# EAGLE design BBB_Breakout_Cape.0 (EAGLE 6.5.0)
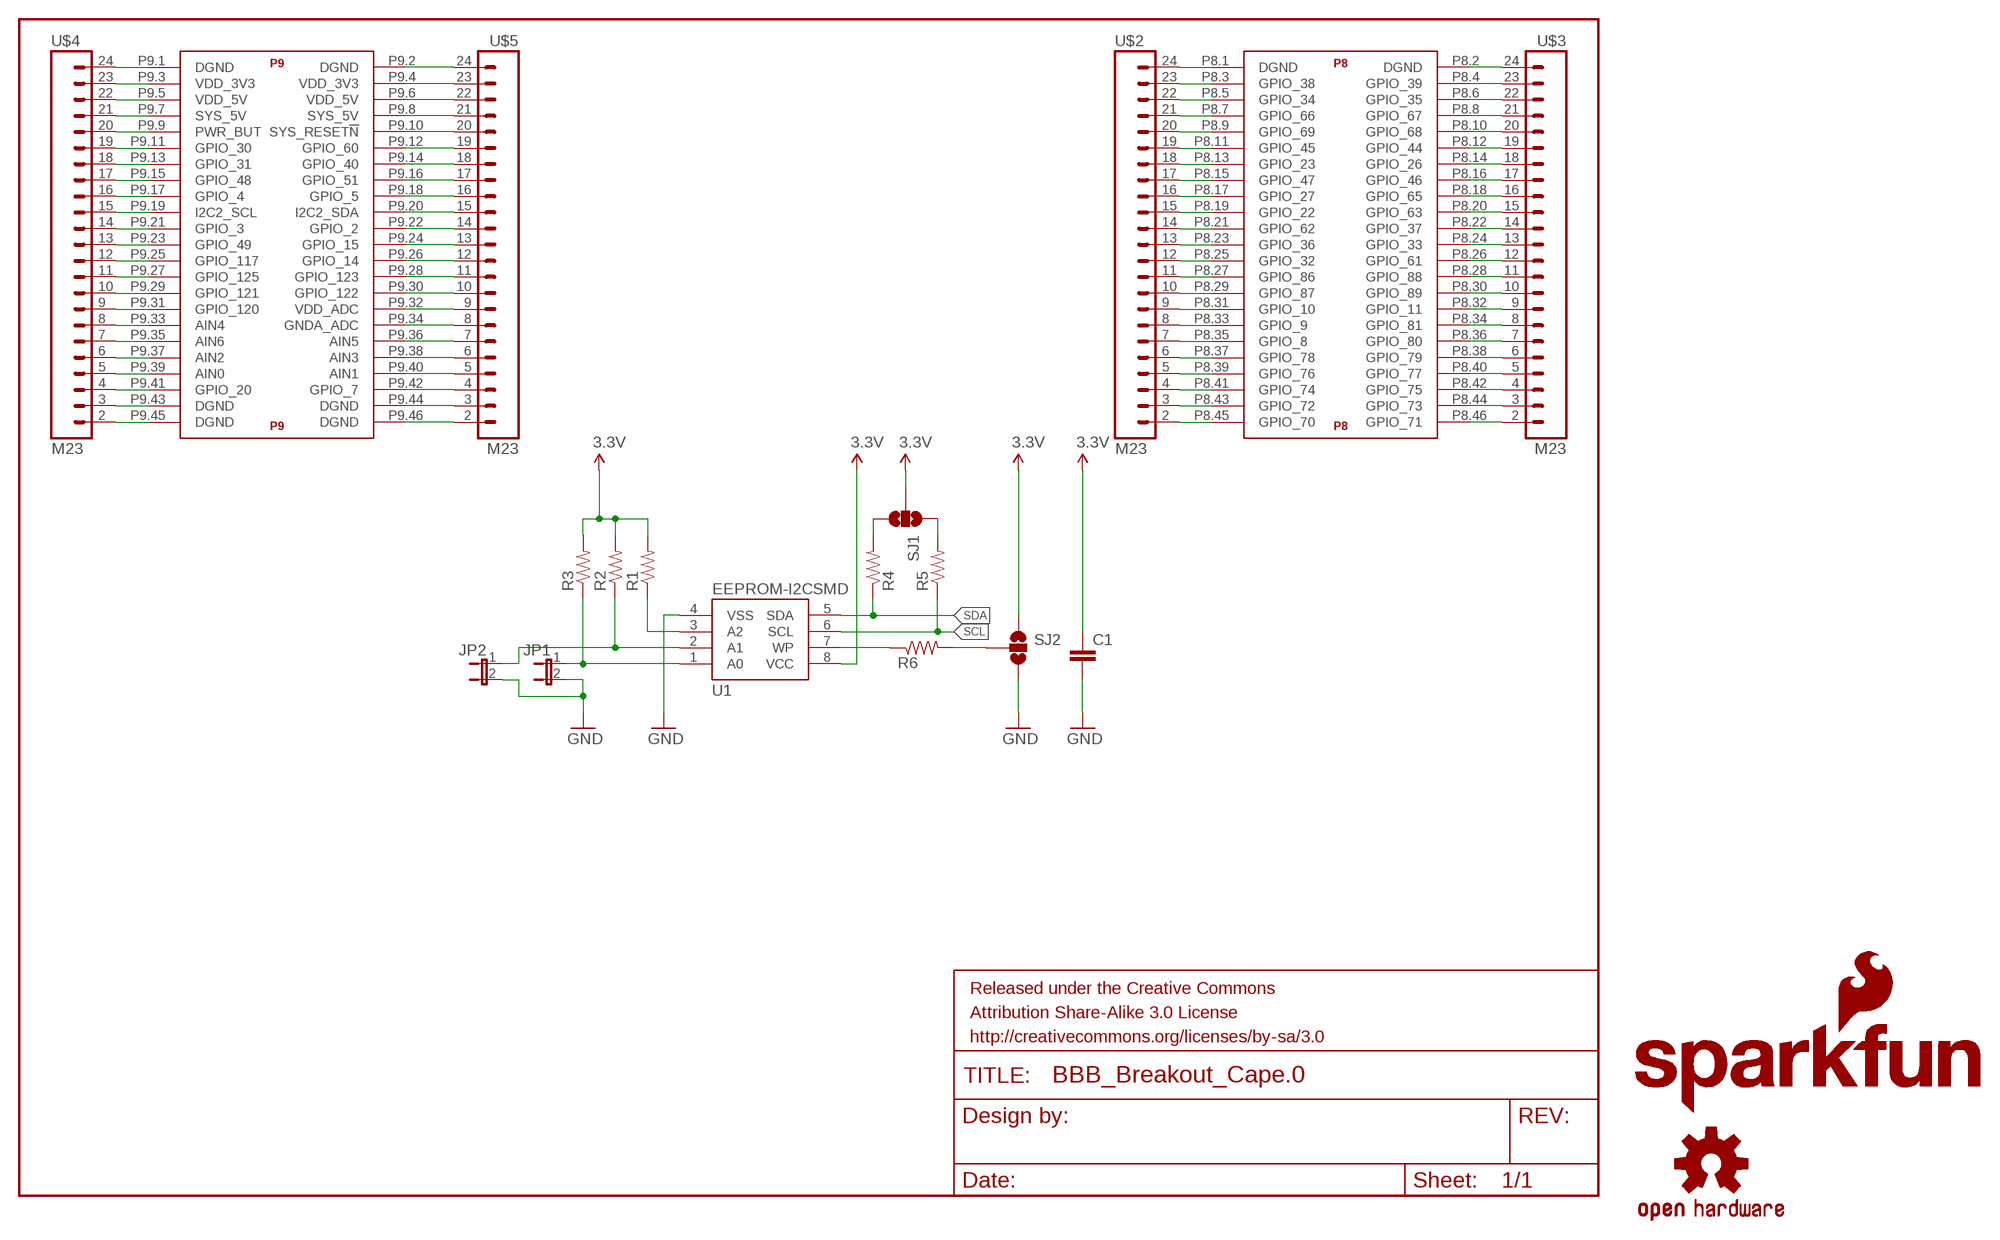
[diagram p0: schematic, sheet 1]

## Parts
C1  0.1UF-25V(+80/-20%)(0603)  [0603-CAP]
FRAME1  FRAME-LETTER  [CREATIVE_COMMONS]
JP1  JUMPER-2SMD-NO  [SJ_2S-NO]
JP2  JUMPER-2SMD-NO  [SJ_2S-NO]
LOGO2  OSHW-LOGOS  [OSHW-LOGO-S]
LOGO3  SFE_LOGO_NAME_FLAME.1_INCH  [SFE_LOGO_NAME_FLAME_.1]
R1  4.7KOHM1/10W1%(0603)  [0603]
R2  4.7KOHM1/10W1%(0603)  [0603]
R3  4.7KOHM1/10W1%(0603)  [0603]
R4  4.7KOHM1/10W1%(0603)  [0603]
R5  4.7KOHM1/10W1%(0603)  [0603]
R6  10KOHM1/10W1%(0603)0603  [0603-RES]
SJ1  SOLDERJUMPER_2WAYPASTE1&2&3  [SJ_3_PASTE1&2&3]
SJ2  SOLDERJUMPER_2WAYPASTE2&3  [SJ_3_PASTE2&3]
U1  EEPROM-I2CSMD  [SO08]
U$1  BEAGLE_BONE_BLACK_CAPE  [BEAGLE_BONE_BLACK_CAPE]
U$2  M23  [1X23]
U$3  M23  [1X23]
U$4  M23  [1X23]
U$5  M23  [1X23]

## Nets
3.3V: C1.1 R1.2 R2.2 R3.2 SJ1.2 SJ2.1 U1.8(VCC)
GND: C1.2 JP1.2 JP2.2 SJ2.3 U1.4(VSS)
N$1: R6.1 U1.7(WP)
N$2: U$1.P8.45(P8:GPIO_70) U$2.2
N$3: R6.2 SJ2.2
N$4: U$1.P8.43(P8:GPIO_72) U$2.3
N$5: U$1.P8.41(P8:GPIO_74) U$2.4
N$6: R1.1 U1.3(A2)
N$7: JP2.1 R2.1 U1.2(A1)
N$8: JP1.1 R3.1 U1.1(A0)
N$9: U$1.P8.39(P8:GPIO_76) U$2.5
N$10: R4.2 SJ1.3
N$11: R5.2 SJ1.1
N$12: U$1.P8.37(P8:GPIO_78) U$2.6
N$13: U$1.P8.35(P8:GPIO_8) U$2.7
N$14: U$1.P8.33(P8:GPIO_9) U$2.8
N$15: U$1.P8.31(P8:GPIO_10) U$2.9
N$16: U$1.P8.29(P8:GPIO_87) U$2.10
N$17: U$1.P8.27(P8:GPIO_86) U$2.11
N$18: U$1.P8.25(P8:GPIO_32) U$2.12
N$19: U$1.P8.23(P8:GPIO_36) U$2.13
N$20: U$1.P8.21(P8:GPIO_62) U$2.14
N$21: U$1.P8.19(P8:GPIO_22) U$2.15
N$22: U$1.P8.17(P8:GPIO_27) U$2.16
N$23: U$1.P8.15(P8:GPIO_47) U$2.17
N$24: U$1.P8.13(P8:GPIO_23) U$2.18
N$25: U$1.P8.11(P8:GPIO_45) U$2.19
N$26: U$1.P8.9(P8:GPIO_69) U$2.20
N$27: U$1.P8.7(P8:GPIO_66) U$2.21
N$28: U$1.P8.5(P8:GPIO_34) U$2.22
N$29: U$1.P8.3(P8:GPIO_38) U$2.23
N$30: U$1.P8.1(P8:DGND) U$2.24
N$31: U$1.P8.46(P8:GPIO_71) U$3.2
N$32: U$1.P8.44(P8:GPIO_73) U$3.3
N$33: U$1.P8.42(P8:GPIO_75) U$3.4
N$34: U$1.P8.40(P8:GPIO_77) U$3.5
N$35: U$1.P8.38(P8:GPIO_79) U$3.6
N$36: U$1.P8.36(P8:GPIO_80) U$3.7
N$37: U$1.P8.34(P8:GPIO_81) U$3.8
N$38: U$1.P8.32(P8:GPIO_11) U$3.9
N$39: U$1.P8.30(P8:GPIO_89) U$3.10
N$40: U$1.P8.28(P8:GPIO_88) U$3.11
N$41: U$1.P8.26(P8:GPIO_61) U$3.12
N$42: U$1.P8.24(P8:GPIO_33) U$3.13
N$43: U$1.P8.22(P8:GPIO_37) U$3.14
N$44: U$1.P8.20(P8:GPIO_63) U$3.15
N$45: U$1.P8.18(P8:GPIO_65) U$3.16
N$46: U$1.P8.16(P8:GPIO_46) U$3.17
N$47: U$1.P8.14(P8:GPIO_26) U$3.18
N$48: U$1.P8.12(P8:GPIO_44) U$3.19
N$49: U$1.P8.10(P8:GPIO_68) U$3.20
N$50: U$1.P8.8(P8:GPIO_67) U$3.21
N$51: U$1.P8.6(P8:GPIO_35) U$3.22
N$52: U$1.P8.4(P8:GPIO_39) U$3.23
N$53: U$1.P8.2(P8:DGND) U$3.24
N$54: U$1.P9.46(P9:DGND) U$5.2
N$55: U$1.P9.44(P9:DGND) U$5.3
N$56: U$1.P9.42(P9:GPIO_7) U$5.4
N$57: U$1.P9.40(P9:AIN1) U$5.5
N$58: U$1.P9.38(P9:AIN3) U$5.6
N$59: U$1.P9.36(P9:AIN5) U$5.7
N$60: U$1.P9.34(P9:GNDA_ADC) U$5.8
N$61: U$1.P9.32(P9:VDD_ADC) U$5.9
N$62: U$1.P9.30(P9:GPIO_122) U$5.10
N$63: U$1.P9.28(P9:GPIO_123) U$5.11
N$64: U$1.P9.26(P9:GPIO_14) U$5.12
N$65: U$1.P9.24(P9:GPIO_15) U$5.13
N$66: U$1.P9.22(P9:GPIO_2) U$5.14
N$67: U$1.P9.20(P9:I2C2_SDA) U$5.15
N$68: U$1.P9.18(P9:GPIO_5) U$5.16
N$69: U$1.P9.16(P9:GPIO_51) U$5.17
N$70: U$1.P9.14(P9:GPIO_40) U$5.18
N$71: U$1.P9.12(P9:GPIO_60) U$5.19
N$72: U$1.P9.10(P9:SYS_RESET!N) U$5.20
N$73: U$1.P9.8(P9:SYS_5V) U$5.21
N$74: U$1.P9.6(P9:VDD_5V) U$5.22
N$75: U$1.P9.4(P9:VDD_3V3) U$5.23
N$76: U$1.P9.2(P9:DGND) U$5.24
N$77: U$1.P9.45(P9:DGND) U$4.2
N$78: U$1.P9.43(P9:DGND) U$4.3
N$79: U$1.P9.41(P9:GPIO_20) U$4.4
N$80: U$1.P9.39(P9:AIN0) U$4.5
N$81: U$1.P9.37(P9:AIN2) U$4.6
N$82: U$1.P9.35(P9:AIN6) U$4.7
N$83: U$1.P9.33(P9:AIN4) U$4.8
N$84: U$1.P9.31(P9:GPIO_120) U$4.9
N$85: U$1.P9.29(P9:GPIO_121) U$4.10
N$86: U$1.P9.27(P9:GPIO_125) U$4.11
N$87: U$1.P9.25(P9:GPIO_117) U$4.12
N$88: U$1.P9.23(P9:GPIO_49) U$4.13
N$89: U$1.P9.21(P9:GPIO_3) U$4.14
N$90: U$1.P9.19(P9:I2C2_SCL) U$4.15
N$91: U$1.P9.17(P9:GPIO_4) U$4.16
N$92: U$1.P9.15(P9:GPIO_48) U$4.17
N$93: U$1.P9.13(P9:GPIO_31) U$4.18
N$94: U$1.P9.11(P9:GPIO_30) U$4.19
N$95: U$1.P9.9(P9:PWR_BUT) U$4.20
N$96: U$1.P9.7(P9:SYS_5V) U$4.21
N$97: U$1.P9.5(P9:VDD_5V) U$4.22
N$98: U$1.P9.3(P9:VDD_3V3) U$4.23
N$99: U$1.P9.1(P9:DGND) U$4.24
SCL: R5.1 U1.6(SCL)
SDA: R4.1 U1.5(SDA)

## Library data of the parts
C1 = SparkFun-Capacitors:0.1UF-25V(+80/-20%)(0603): CAP-00810 Ceramic Standard decoupling cap; PROD_ID: CAP-00810; VALUE: 0.1uF
FRAME1 = SparkFun-Aesthetics:FRAME-LETTER: Schematic Frame Standard 8.5x11 US Letter frame
JP1 JP2 = SparkFun-Passives:JUMPER-2: Jumper Basic 0.1" spaced jumper. Use with breakaway headers.
LOGO2 = SparkFun-Aesthetics:OSHW-LOGO: Open Source Hardware Logo This logo indicates the piece of hardware it is found on incorporates a OSHW license and/or adheres to the definition of open source hardware found here: http://freedomdefined.org/OSHW
LOGO3 = SparkFun-Aesthetics:SFE_LOGO_NAME_FLAME: SFE Logo, name and flame This is the SparkFun full logo. The logo on the schematic will always be the same size; the package variant is the height of the flame part of the logo. Default layer for the logo on the board is tSilk.
R1-R5 = SparkFun-Resistors:4.7KOHM1/10W1%(0603): RES-07857; PROD_ID: RES-07857
R6 = SparkFun-Resistors:10KOHM1/10W1%(0603): RES-00824; PROD_ID: RES-00824; VALUE: 10K
SJ1 SJ2 = SparkFun-Passives:SOLDERJUMPER_2WAY: Solder Jumper 2 way solder jumper
U1 = SparkFun-DigitalIC:EEPROM-I2C: I2C EEPROM chips, 24LC256 (and others)
U$1 = SparkFun-Boards:BEAGLE_BONE_BLACK_CAPE
U$2-U$5 = SparkFun-Connectors:M23

## Board
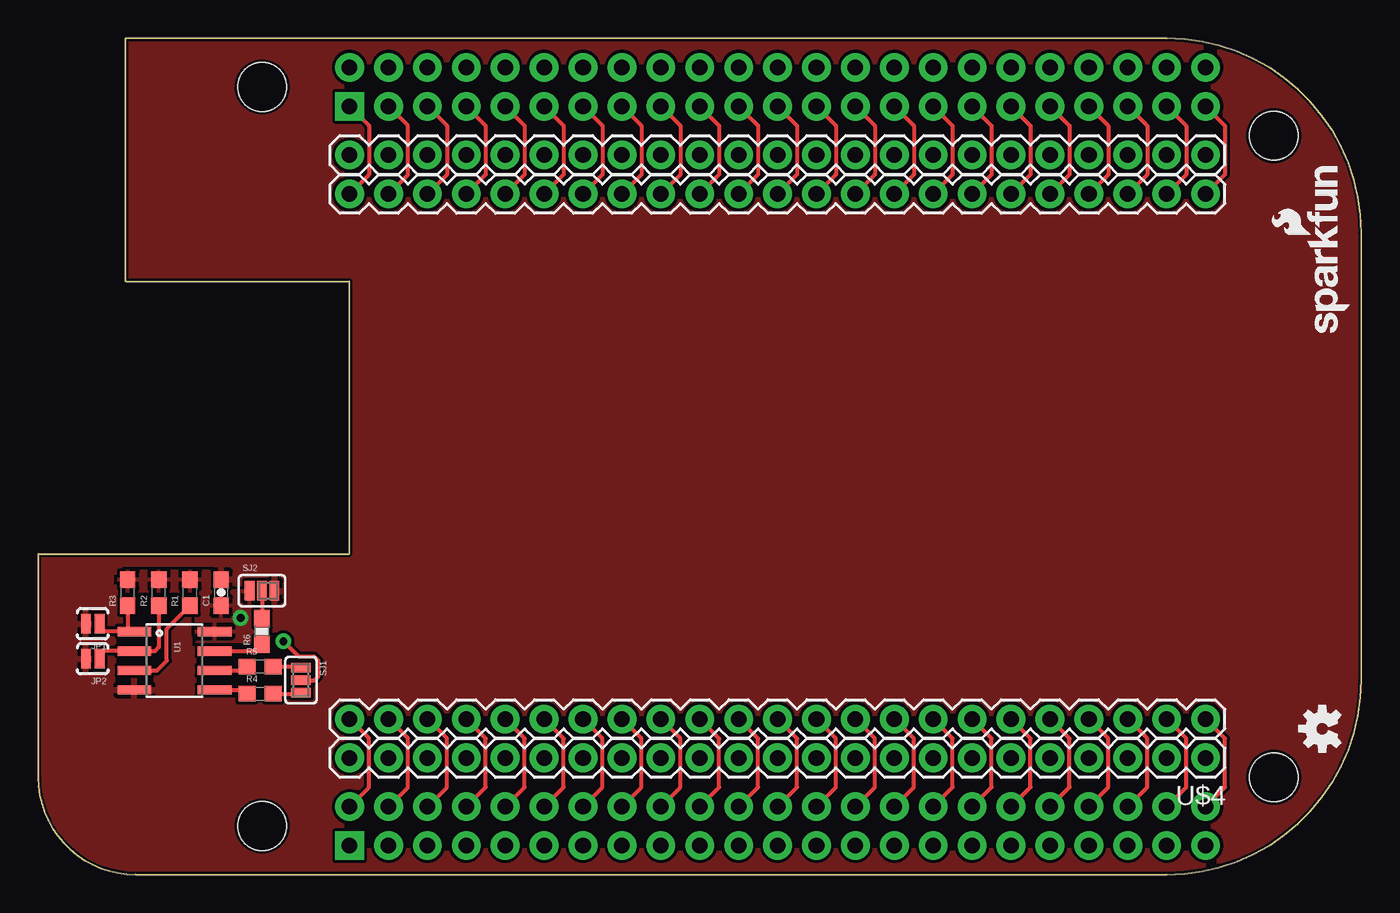
[diagram p1: board, top side]
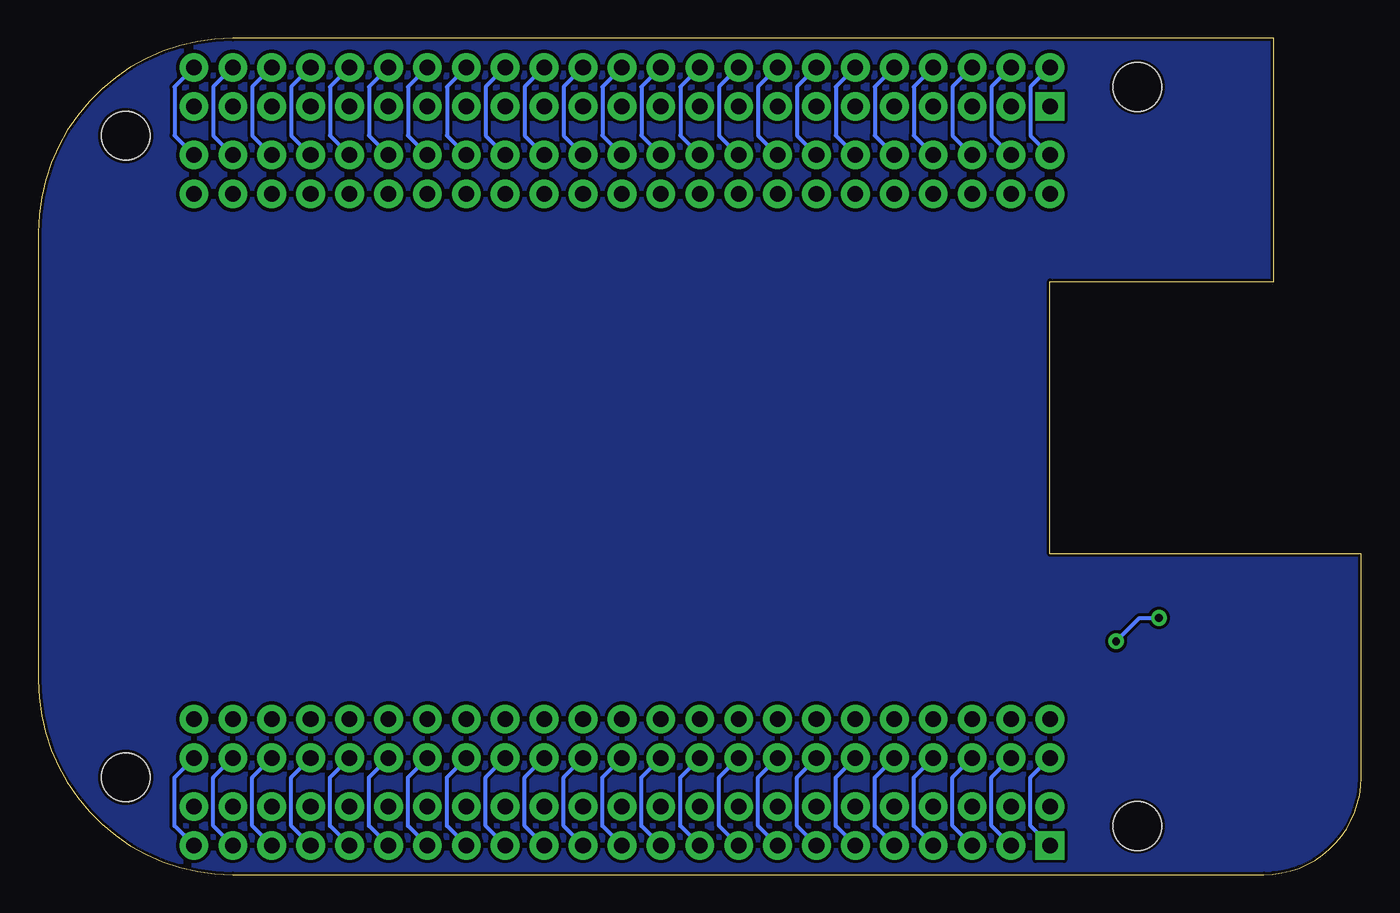
[diagram p2: board, bottom side, seen from below]

Size 86.36 x 54.61 mm. Coordinates in mm from the lower left corner, seen from the top.
Outline: 0,20.95 20.32,20.95 20.32,38.73 5.71,38.73 5.71,54.61 73.66,54.61 arc-90 86.36,41.91 86.36,12.7 arc-90 73.66,0 6.35,0 arc-90 0,6.35 0,20.95
Copper layers (1*16): Top 0.035mm / dielectric 1.5mm / Bottom 0.035mm
Design rules "SparkFun-2-layer": minimum track width 7mil, minimum drill 15mil, track to track 8mil, track to pad 8mil, pad to pad 8mil, via to via 8mil, smd to smd 8mil, copper to edge 8mil, drill to drill 8mil, minimum pad ring 12mil, minimum via ring 10mil, stop-mask expansion 4mil, vias tented up to drill 20mil, thermal gap 10mil

### Footprints (pad centres in the part's own frame; a part is rotated, then mirrored left to right if it is on the bottom)
0603-CAP = smd 1.1 x 1: 1 -0.85,0; 2 0.85,0
SJ_2S-NO = smd 0.635 x 1.27: 1 -0.45,0; 2 0.45,0
0603 = smd 1.1 x 1: 1 -0.85,0; 2 0.85,0
0603-RES = smd 1.1 x 1: 1 -0.85,0; 2 0.85,0
SJ_3_PASTE1&2&3 = smd 0.635 x 1.27: 1 -0.813,0; 2 0,0; 3 0.813,0
SJ_3_PASTE2&3 = smd 0.635 x 1.27: 1 -0.813,0; 2 0,0; 3 0.813,0
SO08 = smd 0.61 x 2.21: 1 -1.905,-2.616; 2 -0.635,-2.616; 3 0.635,-2.616; 4 1.905,-2.616; 5 1.905,2.616; 6 0.635,2.616; 7 -0.635,2.616; 8 -1.905,2.616
BEAGLE_BONE_BLACK_CAPE = drill 1.016 pad 1.88 square: P8.1 20.32,50.165; P9.1 20.32,1.905 | drill 1.016 pad 1.88: P8.2 20.32,52.705; P8.3 22.86,50.165; P8.4 22.86,52.705; P8.5 25.4,50.165; P8.6 25.4,52.705; P8.7 27.94,50.165; P8.8 27.94,52.705; P8.9 30.48,50.165; P8.10 30.48,52.705; P8.11 33.02,50.165; P8.12 33.02,52.705; P8.13 35.56,50.165; P8.14 35.56,52.705; P8.15 38.1,50.165; P8.16 38.1,52.705; P8.17 40.64,50.165; P8.18 40.64,52.705; P8.19 43.18,50.165; P8.20 43.18,52.705; P8.21 45.72,50.165; P8.22 45.72,52.705; P8.23 48.26,50.165; P8.24 48.26,52.705; P8.25 50.8,50.165; P8.26 50.8,52.705; P8.27 53.34,50.165; P8.28 53.34,52.705; P8.29 55.88,50.165; P8.30 55.88,52.705; P8.31 58.42,50.165; P8.32 58.42,52.705; P8.33 60.96,50.165; P8.34 60.96,52.705; P8.35 63.5,50.165; P8.36 63.5,52.705; P8.37 66.04,50.165; P8.38 66.04,52.705; P8.39 68.58,50.165; P8.40 68.58,52.705; P8.41 71.12,50.165; P8.42 71.12,52.705; P8.43 73.66,50.165; P8.44 73.66,52.705; P8.45 76.2,50.165; P8.46 76.2,52.705; P9.2 20.32,4.445; P9.3 22.86,1.905; P9.4 22.86,4.445; P9.5 25.4,1.905; P9.6 25.4,4.445; P9.7 27.94,1.905; P9.8 27.94,4.445; P9.9 30.48,1.905; P9.10 30.48,4.445; P9.11 33.02,1.905; P9.12 33.02,4.445; P9.13 35.56,1.905; P9.14 35.56,4.445; P9.15 38.1,1.905; P9.16 38.1,4.445; P9.17 40.64,1.905; P9.18 40.64,4.445; P9.19 43.18,1.905; P9.20 43.18,4.445; P9.21 45.72,1.905; P9.22 45.72,4.445; P9.23 48.26,1.905; P9.24 48.26,4.445; P9.25 50.8,1.905; P9.26 50.8,4.445; P9.27 53.34,1.905; P9.28 53.34,4.445; P9.29 55.88,1.905; P9.30 55.88,4.445; P9.31 58.42,1.905; P9.32 58.42,4.445; P9.33 60.96,1.905; P9.34 60.96,4.445; P9.35 63.5,1.905; P9.36 63.5,4.445; P9.37 66.04,1.905; P9.38 66.04,4.445; P9.39 68.58,1.905; P9.40 68.58,4.445; P9.41 71.12,1.905; P9.42 71.12,4.445; P9.43 73.66,1.905; P9.44 73.66,4.445; P9.45 76.2,1.905; P9.46 76.2,4.445 | hole 3.175: 14.605,3.175; 80.645,6.35; 80.645,48.26; 14.605,51.435
1X23 = drill 1.016 pad 1.88: 2 -26.67,0; 3 -24.13,0; 4 -21.59,0; 5 -19.05,0; 6 -16.51,0; 7 -13.97,0; 8 -11.43,0; 9 -8.89,0; 10 -6.35,0; 11 -3.81,0; 12 -1.27,0; 13 1.27,0; 14 3.81,0; 15 6.35,0; 16 8.89,0; 17 11.43,0; 18 13.97,0; 19 16.51,0; 20 19.05,0; 21 21.59,0; 22 24.13,0; 23 26.67,0; 24 29.21,0

### Placement (x,y rotation side)
C1  11.94,18.41 90 top
FRAME1  20.32,-10.16 0 top  (outside the outline)
JP1  3.56,16.38 180 top
JP2  3.56,14.1 180 top
LOGO2  83.82,9.53 90 top
LOGO3  85.72,34.92 90 top
R1  9.91,18.41 90 top
R2  7.87,18.41 90 top
R3  5.84,18.41 90 top
R4  14.48,11.81 0 top
R5  14.48,13.59 0 top
R6  14.61,15.88 90 top
SJ1  17.14,12.7 270 top
SJ2  14.61,18.54 0 top
U1  8.89,13.97 270 top
U$1  0,0 0 top
U$2  49.53,44.45 180 top
U$3  49.53,46.99 180 top
U$4  49.53,7.62 180 top
U$5  49.53,10.16 180 top

### Tracks (layer width: path | path; a pad name or v marks a point on that pad's centre or on a via)
3.3V  (via drill 0.51)
  Top 0.254: R1.2 10.24,19.14 | SJ1.2 18.03,12.7 18.29,12.95 18.29,13.97 18.03,14.22 17.02,14.22 v16,15.24
  Bottom 0.254: v16,15.24 14.48,16.76 v13.21,16.76
  pour Top: 10.29,15.24 14.22,15.24 14.22,18.54 11.18,18.54 11.18,19.81 5.21,19.81 5.21,18.54 10.29,18.54
GND
  pour Top (rank 6): 0,20.95 20.32,20.95 20.32,38.73 5.71,38.73 5.71,54.61 73.66,54.61 arc-90 86.36,41.91 86.36,12.7 arc-90 73.66,0 6.35,0 arc-90 0,6.35
  pour Bottom: 0,20.95 20.32,20.95 20.32,38.73 5.71,38.73 5.71,54.61 73.66,54.61 arc-90 86.36,41.91 86.36,12.7 arc-90 73.66,0 6.35,0 arc-90 0,6.35
N$1
  Top 0.254: U1.7 14.22,14.61 14.35,14.73 R6.1 14.48,14.86
N$2
  Top 0.254: U$1.P8.45 77.47,48.9 77.47,45.72 U$2.2
N$3
  Top 0.254: SJ2.2 R6.2
N$4
  Top 0.254: U$1.P8.43 74.93,48.9 74.93,45.72 U$2.3
N$5
  Top 0.254: U$1.P8.41 72.39,48.9 72.39,45.72 U$2.4
N$6
  Top 0.254: U1.3 7.75,13.34 8.38,13.97 8.38,16.04 R1.1
N$7
  Top 0.254: R2.1 7.87,14.86 7.62,14.61 U1.2 4.01,14.61 JP2.1
N$8
  Top 0.254: R3.1 5.84,15.88 | 5.84,15.88 U1.1 | 5.84,15.88 4.06,15.88 4.06,16.38 JP1.1
N$9
  Top 0.254: U$1.P8.39 69.85,48.9 69.85,45.72 U$2.5
N$10
  Top 0.254: R4.2 17.07,11.81 SJ1.3
N$11
  Top 0.254: R5.2 17.02,13.59 17.14,13.46 SJ1.1
N$12
  Top 0.254: U$1.P8.37 67.31,48.9 67.31,45.72 U$2.6
N$13
  Top 0.254: U$1.P8.35 64.77,48.9 64.77,45.72 U$2.7
N$14
  Top 0.254: U$1.P8.33 62.23,48.9 62.23,45.72 U$2.8
N$15
  Top 0.254: U$1.P8.31 59.69,48.9 59.69,45.72 U$2.9
N$16
  Top 0.254: U$1.P8.29 57.15,48.9 57.15,45.72 U$2.10
N$17
  Top 0.254: U$1.P8.27 54.61,48.9 54.61,45.72 U$2.11
N$18
  Top 0.254: U$1.P8.25 52.07,48.9 52.07,45.72 U$2.12
N$19
  Top 0.254: U$1.P8.23 49.53,48.9 49.53,45.72 U$2.13
N$20
  Top 0.254: U$1.P8.21 46.99,48.9 46.99,45.72 U$2.14
N$21
  Top 0.254: U$1.P8.19 44.45,48.9 44.45,45.72 U$2.15
N$22
  Top 0.254: U$1.P8.17 41.91,48.9 41.91,45.72 U$2.16
N$23
  Top 0.254: U$1.P8.15 39.37,48.9 39.37,45.72 U$2.17
N$24
  Top 0.254: U$1.P8.13 36.83,48.9 36.83,45.72 U$2.18
N$25
  Top 0.254: U$1.P8.11 34.29,48.9 34.29,45.72 U$2.19
N$26
  Top 0.254: U$1.P8.9 31.75,48.9 31.75,45.72 U$2.20
N$27
  Top 0.254: U$1.P8.7 29.21,48.9 29.21,45.72 U$2.21
N$28
  Top 0.254: U$1.P8.5 26.67,48.9 26.67,45.72 U$2.22
N$29
  Top 0.254: U$2.23 24.13,45.72 24.13,48.9 U$1.P8.3
N$30
  Top 0.254: U$1.P8.1 21.59,48.9 21.59,45.72 U$2.24
N$31
  Bottom 0.254: U$1.P8.46 77.47,51.44 77.47,48.26 U$3.2
N$32
  Bottom 0.254: U$1.P8.44 74.93,51.44 74.93,48.26 U$3.3
N$33
  Bottom 0.254: U$1.P8.42 72.39,51.44 72.39,48.26 U$3.4
N$34
  Bottom 0.254: U$1.P8.40 69.85,51.44 69.85,48.26 U$3.5
N$35
  Bottom 0.254: U$1.P8.38 67.31,51.44 67.31,48.26 U$3.6
N$36
  Bottom 0.254: U$1.P8.36 64.77,51.44 64.77,48.26 U$3.7
N$37
  Bottom 0.254: U$1.P8.34 62.23,51.44 62.23,48.26 U$3.8
N$38
  Bottom 0.254: U$1.P8.32 59.69,51.44 59.69,48.26 U$3.9
N$39
  Bottom 0.254: U$1.P8.30 57.15,51.44 57.15,48.26 U$3.10
N$40
  Bottom 0.254: U$1.P8.28 54.61,51.44 54.61,48.26 U$3.11
N$41
  Bottom 0.254: U$1.P8.26 52.07,51.44 52.07,48.26 U$3.12
N$42
  Bottom 0.254: U$1.P8.24 49.53,51.44 49.53,48.26 U$3.13
N$43
  Bottom 0.254: U$1.P8.22 46.99,51.44 46.99,48.26 U$3.14
N$44
  Bottom 0.254: U$1.P8.20 44.45,51.44 44.45,48.26 U$3.15
N$45
  Bottom 0.254: U$1.P8.18 41.91,51.44 41.91,48.26 U$3.16
N$46
  Bottom 0.254: U$1.P8.16 39.37,51.44 39.37,48.26 U$3.17
N$47
  Bottom 0.254: U$1.P8.14 36.83,51.44 36.83,48.26 U$3.18
N$48
  Bottom 0.254: U$1.P8.12 34.29,51.44 34.29,48.26 U$3.19
N$49
  Bottom 0.254: U$1.P8.10 31.75,51.44 31.75,48.26 U$3.20
N$50
  Bottom 0.254: U$1.P8.8 29.21,51.44 29.21,48.26 U$3.21
N$51
  Bottom 0.254: U$1.P8.6 26.67,51.44 26.67,48.26 U$3.22
N$52
  Bottom 0.254: U$1.P8.4 24.13,51.44 24.13,48.26 U$3.23
N$53
  Bottom 0.254: U$1.P8.2 21.59,51.44 21.59,48.26 U$3.24
N$54
  Top 0.254: U$1.P9.46 77.47,5.71 77.47,8.89 U$5.2
N$55
  Top 0.254: U$1.P9.44 74.93,5.71 74.93,8.89 U$5.3
N$56
  Top 0.254: U$1.P9.42 72.39,5.71 72.39,8.89 U$5.4
N$57
  Top 0.254: U$1.P9.40 69.85,5.71 69.85,8.89 U$5.5
N$58
  Top 0.254: U$1.P9.38 67.31,5.71 67.31,8.89 U$5.6
N$59
  Top 0.254: U$1.P9.36 64.77,5.71 64.77,8.89 U$5.7
N$60
  Top 0.254: U$1.P9.34 62.23,5.71 62.23,8.89 U$5.8
N$61
  Top 0.254: U$1.P9.32 59.69,5.71 59.69,8.89 U$5.9
N$62
  Top 0.254: U$1.P9.30 57.15,5.71 57.15,8.89 U$5.10
N$63
  Top 0.254: U$1.P9.28 54.61,5.71 54.61,8.89 U$5.11
N$64
  Top 0.254: U$1.P9.26 52.07,5.71 52.07,8.89 U$5.12
N$65
  Top 0.254: U$1.P9.24 49.53,5.71 49.53,8.89 U$5.13
N$66
  Top 0.254: U$1.P9.22 46.99,5.71 46.99,8.89 U$5.14
N$67
  Top 0.254: U$1.P9.20 44.45,5.71 44.45,8.89 U$5.15
N$68
  Top 0.254: U$1.P9.18 41.91,5.71 41.91,8.89 U$5.16
N$69
  Top 0.254: U$1.P9.16 39.37,5.71 39.37,8.89 U$5.17
N$70
  Top 0.254: U$1.P9.14 36.83,5.71 36.83,8.89 U$5.18
N$71
  Top 0.254: U$1.P9.12 34.29,5.71 34.29,8.89 U$5.19
N$72
  Top 0.254: U$1.P9.10 31.75,5.71 31.75,8.89 U$5.20
N$73
  Top 0.254: U$1.P9.8 29.21,5.71 29.21,8.89 U$5.21
N$74
  Top 0.254: U$1.P9.6 26.67,5.71 26.67,8.89 U$5.22
N$75
  Top 0.254: U$1.P9.4 24.13,5.71 24.13,8.89 U$5.23
N$76
  Top 0.254: U$1.P9.2 21.59,5.71 21.59,8.89 U$5.24
N$77
  Bottom 0.254: U$1.P9.45 77.47,3.17 77.47,6.35 U$4.2
N$78
  Bottom 0.254: U$1.P9.43 74.93,3.17 74.93,6.35 U$4.3
N$79
  Bottom 0.254: U$1.P9.41 72.39,3.17 72.39,6.35 U$4.4
N$80
  Bottom 0.254: U$1.P9.39 69.85,3.17 69.85,6.35 U$4.5
N$81
  Bottom 0.254: U$1.P9.37 67.31,3.17 67.31,6.35 U$4.6
N$82
  Bottom 0.254: U$1.P9.35 64.77,3.17 64.77,6.35 U$4.7
N$83
  Bottom 0.254: U$1.P9.33 62.23,3.17 62.23,6.35 U$4.8
N$84
  Bottom 0.254: U$1.P9.31 59.69,3.17 59.69,6.35 U$4.9
N$85
  Bottom 0.254: U$1.P9.29 57.15,3.17 57.15,6.35 U$4.10
N$86
  Bottom 0.254: U$1.P9.27 54.61,3.17 54.61,6.35 U$4.11
N$87
  Bottom 0.254: U$1.P9.25 52.07,3.17 52.07,6.35 U$4.12
N$88
  Bottom 0.254: U$1.P9.23 49.53,3.17 49.53,6.35 U$4.13
N$89
  Bottom 0.254: U$1.P9.21 46.99,3.17 46.99,6.35 U$4.14
N$90
  Bottom 0.254: U$1.P9.19 44.45,3.17 44.45,6.35 U$4.15
N$91
  Bottom 0.254: U$1.P9.17 41.91,3.17 41.91,6.35 U$4.16
N$92
  Bottom 0.254: U$1.P9.15 39.37,3.17 39.37,6.35 U$4.17
N$93
  Bottom 0.254: U$1.P9.13 36.83,3.17 36.83,6.35 U$4.18
N$94
  Bottom 0.254: U$1.P9.11 34.29,3.17 34.29,6.35 U$4.19
N$95
  Bottom 0.254: U$1.P9.9 31.75,3.17 31.75,6.35 U$4.20
N$96
  Bottom 0.254: U$1.P9.7 29.21,3.17 29.21,6.35 U$4.21
N$97
  Bottom 0.254: U$1.P9.5 26.67,3.17 26.67,6.35 U$4.22
N$98
  Bottom 0.254: U$1.P9.3 24.13,3.17 24.13,6.35 U$4.23
N$99
  Bottom 0.254: U$1.P9.1 21.59,3.17 21.59,6.35 U$4.24
SCL
  Top 0.254: U1.6 13.37,13.34 R5.1
SDA
  Top 0.254: U1.5 13.37,12.06 R4.1

### Text on the board
tDocu: Casey Kuhns